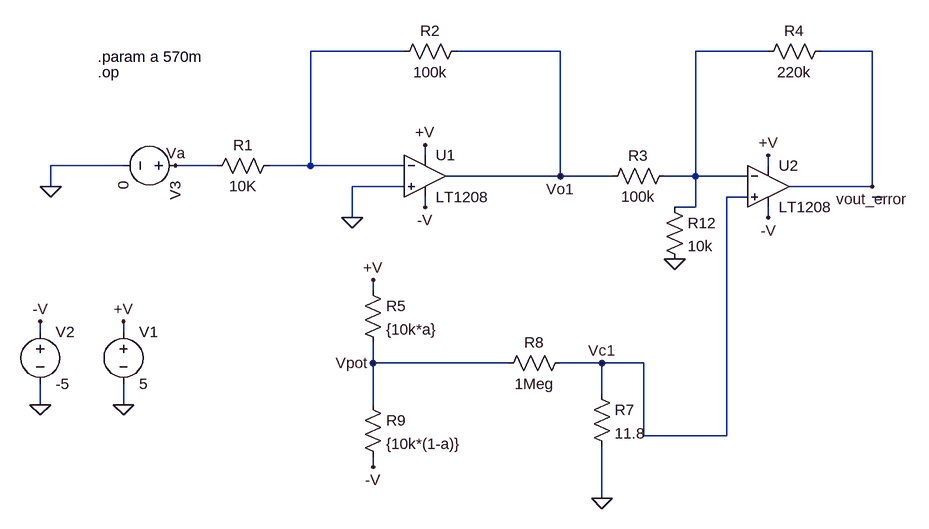
[diagram p0: schematic ETAJ1 COMPENSARE DC.asc]
ETAJ1 COMPENSARE DC.asc, the LTspice schematic file:
Version 4
SHEET 1 1024 708
WIRE 224 -80 80 -80
WIRE 464 -80 304 -80
WIRE 784 -80 672 -80
WIRE 944 -80 864 -80
WIRE 256 80 256 64
WIRE -208 96 -320 96
WIRE -64 96 -128 96
WIRE 80 96 80 -80
WIRE 80 96 16 96
WIRE 224 96 80 96
WIRE 784 96 784 80
WIRE 464 112 464 -80
WIRE 464 112 288 112
WIRE 544 112 464 112
WIRE 672 112 672 -80
WIRE 672 112 624 112
WIRE 752 112 672 112
WIRE -320 128 -320 96
WIRE 224 128 144 128
WIRE 944 128 944 -80
WIRE 944 128 816 128
WIRE 752 144 720 144
WIRE 960 144 944 144
WIRE 256 160 256 144
WIRE 672 160 672 112
WIRE 672 160 640 160
WIRE 144 176 144 128
WIRE 784 176 784 160
WIRE 176 288 176 272
WIRE -336 352 -336 336
WIRE -208 352 -208 336
WIRE 176 400 176 368
WIRE 384 400 176 400
WIRE 528 400 464 400
WIRE 592 400 528 400
WIRE 528 448 528 400
WIRE -336 464 -336 432
WIRE -208 464 -208 432
WIRE 176 464 176 400
WIRE 592 512 592 400
WIRE 720 512 720 144
WIRE 720 512 592 512
WIRE 176 560 176 544
WIRE 528 608 528 528
FLAG -208 464 0
FLAG 256 64 +V
FLAG -208 336 +V
FLAG 256 160 -V
FLAG -336 464 0
FLAG -336 336 -V
FLAG 784 80 +V
FLAG 784 176 -V
FLAG 464 112 Vo1
FLAG -128 96 Va
FLAG 944 128 vout_error
FLAG -320 128 0
FLAG 528 400 Vc1
FLAG 144 176 0
FLAG 176 272 +V
FLAG 176 560 -V
FLAG 176 400 Vpot
FLAG 528 608 0
FLAG 640 240 0
DATAFLAG 80 64 ""
DATAFLAG 720 160 ""
DATAFLAG 688 112 ""
DATAFLAG 912 128 ""
SYMBOL voltage -208 336 R0
WINDOW 123 0 0 Left 2
WINDOW 39 0 0 Left 2
SYMATTR InstName V1
SYMATTR Value 5
SYMBOL voltage -336 336 R0
WINDOW 123 0 0 Left 2
WINDOW 39 0 0 Left 2
SYMATTR InstName V2
SYMATTR Value -5
SYMBOL res 32 80 R90
WINDOW 0 0 56 VBottom 2
WINDOW 3 32 56 VTop 2
SYMATTR InstName R1
SYMATTR Value 10K
SYMBOL res 320 -96 R90
WINDOW 0 0 56 VBottom 2
WINDOW 3 32 56 VTop 2
SYMATTR InstName R2
SYMATTR Value 100k
SYMBOL res 640 96 R90
WINDOW 0 0 56 VBottom 2
WINDOW 3 32 56 VTop 2
SYMATTR InstName R3
SYMATTR Value 100k
SYMBOL res 880 -96 R90
WINDOW 0 0 56 VBottom 2
WINDOW 3 32 56 VTop 2
SYMATTR InstName R4
SYMATTR Value 220k
SYMBOL OpAmps\\LT1208 256 48 R0
SYMATTR InstName U1
SYMBOL OpAmps\\LT1208 784 64 R0
SYMATTR InstName U2
SYMBOL voltage -112 96 R90
WINDOW 123 0 0 Left 0
WINDOW 39 0 0 Left 0
SYMATTR InstName V3
SYMATTR Value 0
SYMBOL res 368 416 R270
WINDOW 0 32 56 VTop 2
WINDOW 3 0 56 VBottom 2
SYMATTR InstName R8
SYMATTR Value 1Meg
SYMBOL res 160 272 R0
SYMATTR InstName R5
SYMATTR Value {10k*a}
SYMBOL res 160 448 R0
SYMATTR InstName R9
SYMATTR Value {10k*(1-a)}
SYMBOL res 512 432 R0
SYMATTR InstName R7
SYMATTR Value 11.8
SYMBOL res 624 144 R0
SYMATTR InstName R12
SYMATTR Value 10k
TEXT -248 -48 Left 2 !.op
TEXT -248 -72 Left 2 !.param a 570m

The netlist it stands for:
* ETAJ1 COMPENSARE DC.asc
V1 +V 0 5
V2 -V 0 -5
R1 N001 Va 10K
R2 Vo1 N001 100k
R3 N002 Vo1 100k
R4 vout_error N002 220k
XU1 0 N001 +V -V Vo1 LT1208  ; pins In+ In- V+ V- OUT
XU2 Vc1 N002 +V -V vout_error LT1208  ; pins In+ In- V+ V- OUT
V3 Va 0 0
R8 Vpot Vc1 1Meg
R5 +V Vpot {10k*a}
R9 Vpot -V {10k*(1-a)}
R7 Vc1 0 11.8
R12 N002 0 10k
.op
.param a 570m
.backanno
.end